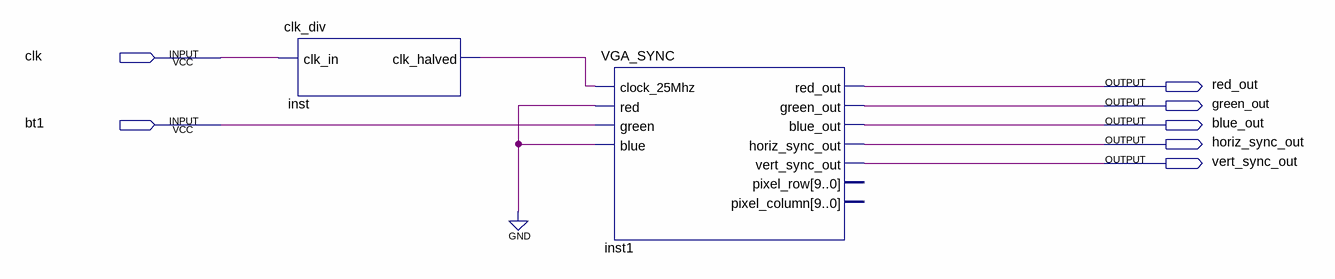
[diagram p0: schematic sheet]
// Quartus schematic VGA_sync_example.bdf as structural Verilog: 2 symbols, 7 pins
module VGA_sync_example (
  input  clk,
  input  bt1,
  output red_out,
  output green_out,
  output blue_out,
  output horiz_sync_out,
  output vert_sync_out
);

  wire inst_clk_halved;

  clk_div inst (.clk_in(clk), .clk_halved(inst_clk_halved));
  VGA_SYNC inst1 (
    .clock_25Mhz(inst_clk_halved), .red(1'b0), .green(bt1), .blue(1'b0), .red_out(red_out),
    .green_out(green_out), .blue_out(blue_out), .horiz_sync_out(horiz_sync_out), .vert_sync_out(vert_sync_out));  // open: pixel_row, pixel_column
endmodule
